# EAGLE design Atmega32U4 (EAGLE 9.6.2)

## Sheet 1 of 2
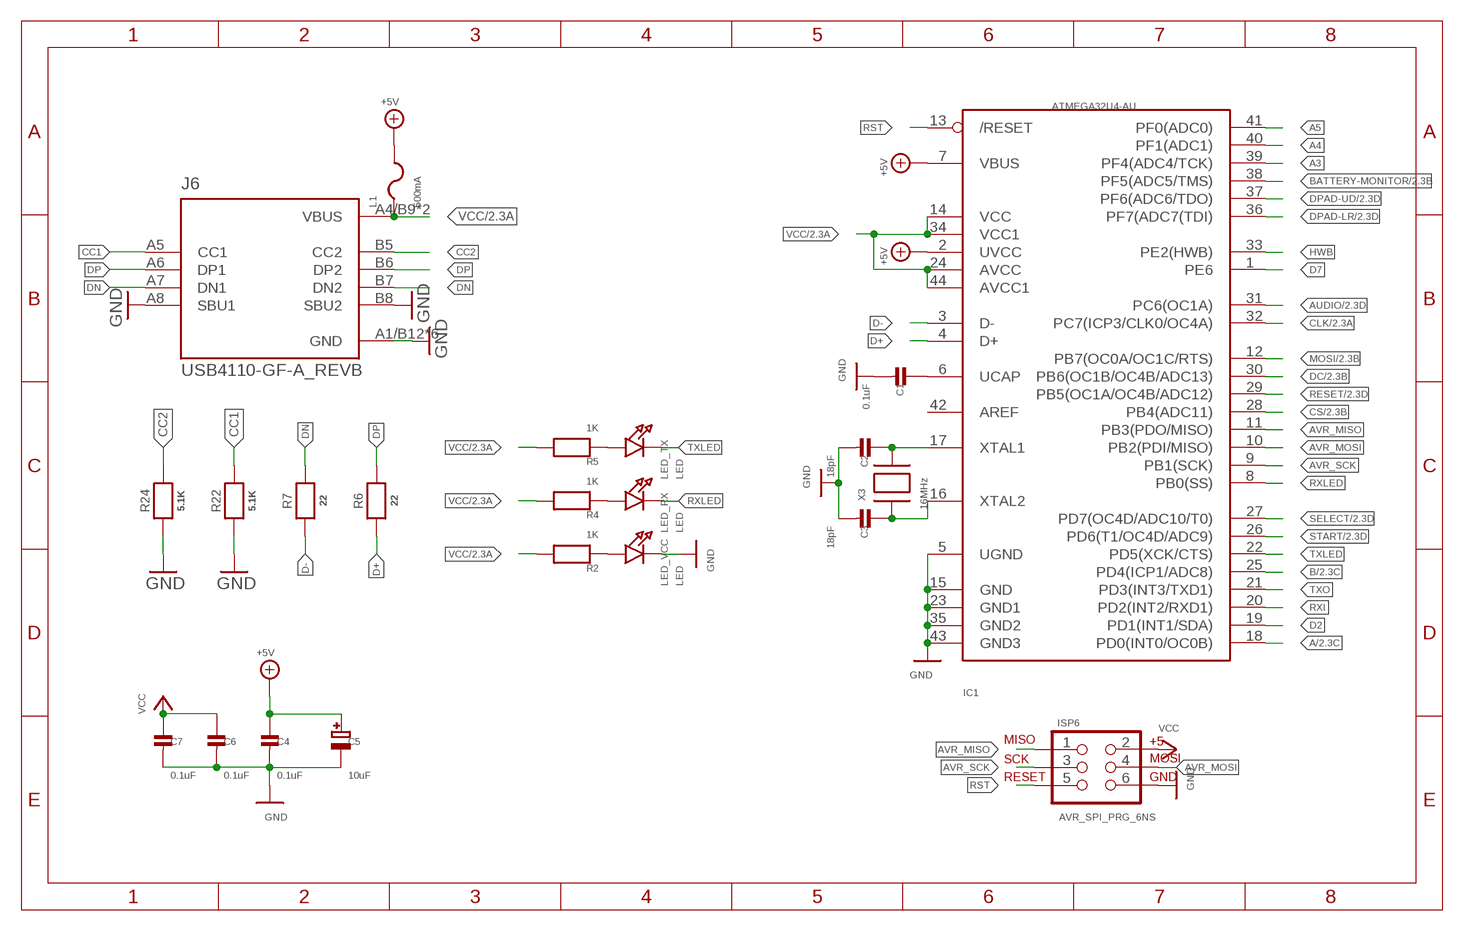
[diagram p0: schematic, sheet 1]

### Parts
C1  0.1uF  CAP_CERAMIC  [0603-MINI-CAP]
C2  18pF  CAP_CERAMIC  [0603-MINI-CAP]
C3  18pF  CAP_CERAMIC  [0603-MINI-CAP]
C4  0.1uF  CAP_CERAMIC  [0603-MINI-CAP]
C5  10uF  CAP_TANTALUMA/3216_WAVE  [EIA3216-18/A-W]
C6  0.1uF  CAP_CERAMIC  [0603-MINI-CAP]
C7  0.1uF  CAP_CERAMIC  [0603-MINI-CAP]
IC1  ATMEGA32U4-AU  [TQFP44]
ISP6  AVR_SPI_PRG_6NS  [2X3-NS]
J6  USB4110-GF-A_REVB  [GCT_USB4110-GF-A_REVB]
L1  500mA  PTCFUSE-1206  [R1206]
LED_RX  LED  LED0603  [CHIPLED_0603]
LED_TX  LED  LED0603  [CHIPLED_0603]
LED_VCC  LED  LED0603  [CHIPLED_0603]
R2  1K  RESISTOR0603MINI  [0603-MINI]
R4  1K  RESISTOR0603MINI  [0603-MINI]
R5  1K  RESISTOR0603MINI  [0603-MINI]
R6  22  RESISTOR0603MINI  [0603-MINI]
R7  22  RESISTOR0603MINI  [0603-MINI]
R22  5.1K  RESISTOR0603MINI  [0603-MINI]
R24  5.1K  RESISTOR0603MINI  [0603-MINI]
X3  16MHz  XTALNX5032  [NX5032]

### Nets
+5V: C4.1 C5.+ IC1.2(UVCC) IC1.7(VBUS) L1.2
A: IC1.18(PD0(INT0/OC0B)) ; also sheet 2
A3: IC1.39(PF4(ADC4/TCK))
A4: IC1.40(PF1(ADC1))
A5: IC1.41(PF0(ADC0))
AUDIO: IC1.31(PC6(OC1A)) ; also sheet 2
AVR_MISO: IC1.11(PB3(PDO/MISO)) ISP6.1
AVR_MOSI: IC1.10(PB2(PDI/MISO)) ISP6.4
AVR_SCK: IC1.9(PB1(SCK)) ISP6.3
B: IC1.25(PD4(ICP1/ADC8)) ; also sheet 2
BATTERY-MONITOR: IC1.38(PF5(ADC5/TMS)) ; also sheet 2
CC1: J6.A5(CC1) R22.2
CC2: J6.B5(CC2) R24.2
CLK: IC1.32(PC7(ICP3/CLK0/OC4A)) ; also sheet 2
CS: IC1.28(PB4(ADC11)) ; also sheet 2
D2: IC1.19(PD1(INT1/SDA))
D7: IC1.1(PE6)
D+: IC1.4(D+) R6.1
D-: IC1.3(D-) R7.1
DC: IC1.30(PB6(OC1B/OC4B/ADC13)) ; also sheet 2
DN: J6.A7(DN1) J6.B7(DN2) R7.2
DP: J6.A6(DP1) J6.B6(DP2) R6.2
DPAD-LR: IC1.36(PF7(ADC7(TDI)) ; also sheet 2
DPAD-UD: IC1.37(PF6(ADC6/TDO)) ; also sheet 2
GND: C1.2 C2.2 C3.2 C4.2 C5.- C6.2 C7.2 IC1.5(UGND) IC1.15(GND) IC1.23(GND1) IC1.35(GND2) IC1.43(GND3) ISP6.6 J6.A1/B12(GND) J6.A8(SBU1) J6.B1/A12(GND) J6.B8(SBU2) J6.S1(GND) J6.S2(GND) J6.S3(GND) J6.S4(GND) LED_VCC.C R22.1 R24.1 ; also sheet 2
HWB: IC1.33(PE2(HWB))
MOSI: IC1.12(PB7(OC0A/OC1C/RTS)) ; also sheet 2
N$2: LED_VCC.A R2.1
N$4: C1.1 IC1.6(UCAP)
N$6: LED_RX.A R4.1
N$7: LED_TX.A R5.1
N$8: C2.1 IC1.17(XTAL1) X3.P$2
N$9: C3.1 IC1.16(XTAL2) X3.P$1
RESET: IC1.29(PB5(OC1A/OC4B/ADC12)) ; also sheet 2
RST: IC1.13(/RESET) ISP6.5
RXI: IC1.20(PD2(INT2/RXD1))
RXLED: IC1.8(PB0(SS)) LED_RX.C
SELECT: IC1.27(PD7(OC4D/ADC10/T0)) ; also sheet 2
START: IC1.26(PD6(T1/OC4D/ADC9)) ; also sheet 2
TXLED: IC1.22(PD5(XCK/CTS)) LED_TX.C
TXO: IC1.21(PD3(INT3/TXD1))
VCC: C6.1 C7.1 IC1.14(VCC) IC1.24(AVCC) IC1.34(VCC1) IC1.44(AVCC1) ISP6.2 J6.A4/B9(VBUS) J6.B4/A9(VBUS) L1.1 R2.2 R4.2 R5.2 ; also sheet 2
Unconnected: IC1.42(AREF)

## Sheet 2 of 2: Board and Logos
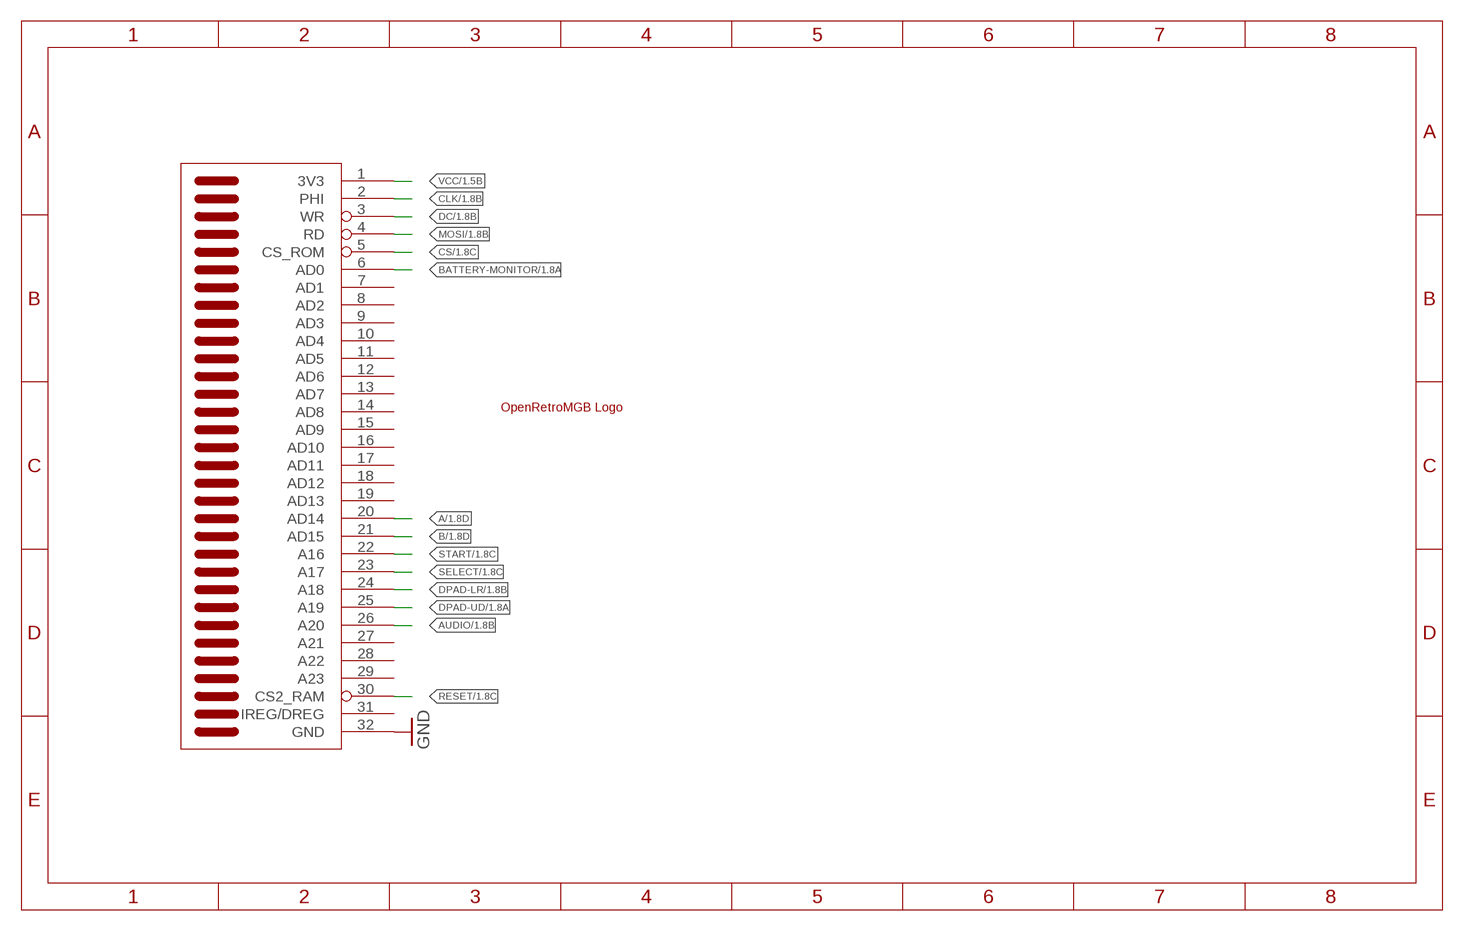
[diagram p1: schematic, sheet 2]

### Parts
U$1  OPENRETROMGB  [OPENRETROMBG]
U$2  GBA_CARTLARGE  [GBCART]

### Nets
A: U$2.20(AD14) ; also sheet 1
AUDIO: U$2.26(A20) ; also sheet 1
B: U$2.21(AD15) ; also sheet 1
BATTERY-MONITOR: U$2.6(AD0) ; also sheet 1
CLK: U$2.2(PHI) ; also sheet 1
CS: U$2.5(CS_ROM) ; also sheet 1
DC: U$2.3(WR) ; also sheet 1
DPAD-LR: U$2.24(A18) ; also sheet 1
DPAD-UD: U$2.25(A19) ; also sheet 1
GND: U$2.32(GND) ; also sheet 1
MOSI: U$2.4(RD) ; also sheet 1
RESET: U$2.30(CS2_RAM) ; also sheet 1
SELECT: U$2.23(A17) ; also sheet 1
START: U$2.22(A16) ; also sheet 1
VCC: U$2.1(3V3) ; also sheet 1
Unconnected: U$2.7(AD1) U$2.8(AD2) U$2.9(AD3) U$2.10(AD4) U$2.11(AD5) U$2.12(AD6) U$2.13(AD7) U$2.14(AD8) U$2.15(AD9) U$2.16(AD10) U$2.17(AD11) U$2.18(AD12) U$2.19(AD13) U$2.27(A21) U$2.28(A22) U$2.29(A23) U$2.31(IREG/DREG)

## Library data of the parts
C1-C4 C6 C7 = RetroESP32:CAP_CERAMIC: Ceramic Capacitors For new designs, use the packages preceded by an '_' character since they are more reliable: The following footprints should be used on most boards: _0402 - Standard footprint for regular board layouts _0603 - Standard footprint for regular board layouts _0805 - Standard footprint for regular board layouts _1206 - Standard footprint for regular board layouts For extremely tight-pitch boards where space is at a premium, the following 'micro-pitch' footprints can be used (smaller pads, no silkscreen outline, etc.): _0402MP - Micro-pitch footprint for very dense/compact boards _0603MP - Micro-pitch footprint for very dense/compact boards _0805MP - Micro-pitch footprint for very dense/compact boards _1206MP - Micro-pitch footprint for very dense/compact boards
C5 = RetroESP32:CAP_TANTALUM: Tantalum Capacitors Wave footprints have larger pads and are meant to be used for hand soldering. Reflow footprints are optimised for solder paste and a reflow oven. EIA3216-18/A-[R/W] - Size A / 3216-18 / 1206 footprint 4.7µF 25V 10% Tantalum Capacitor 10µF 16V 10% Tantalum Capacitor [Digikey: 495-2236-2-ND] EIA3528-21/B-[R/W] - Size B / 3528-21 47µF 10V 10% Tantalum Capactior [Digikey: 495-2216-1-ND] EIA6032-28/C-[R/W] - Size C / 6032-28 10µF 35V 20% Tantalum Capacitor [Digikey: 495-2285-1-ND] 100µF 16V 10% Tantalum Capactior [Digikey: 399-5214-1-ND]
IC1 = adaprog:ATMEGA32U4
ISP6 = SparkFun:AVR_SPI_PRG_6: AVR ISP 6 Pin This is the reduced ISP connector for AVR programming. Common on Arduino. This footprint will take up less PCB space and can be used with a 10-pin to 6-pin adapter such as SKU: BOB-08508
J6 = USB4110-GF-A:USB4110-GF-A_REVB: Check availability <https://pricing.snapeda.com/parts/USB4110-GF-A/GCT/view-part?ref=eda>; AVAILABILITY: In Stock; DESCRIPTION: USB-C (USB TYPE-C) USB 2.0 Receptacle Connector 24 (16+8 Dummy) Position Surface Mount, Right Angle; Through Hole; MF: GCT; MP: USB4110-GF-A; MPN: USB4105-GF-A; PACKAGE: None; PRICE: None; PURCHASE-URL: https://pricing.snapeda.com/search/part/USB4110-GF-A/?ref=eda
L1 = adafruit:PTCFUSE: PTC fuses, resettable thermistors
LED_RX LED_TX LED_VCC = RetroESP32:LED: LED 0603 - 0603 Surface Mount Package 2mA: Green LED - Low Power (3.9mcd, 2ma, 1.7Vf) - Digikey: 475-2709-2-ND Orange LED - Low Power (9.8mcd, 2ma, 1.8Vf) - Digikey: 475-1194-2-ND Red LED - Low Power (5mcd, 2ma, 1.8Vf) - Digikey: 475-1195-2-ND Yellow LED - Low Power (7mcd, 2ma, 1.8Vf) - Digikey: 475-1196-2-ND 5mA: Blue LED - Low Power (17mcd, 5ma, 2.9Vf) - Digikey: LNJ937W8CRACT-ND 0805 - 0805 Surface Mount Package 2mA: Red LED (8.8mcd, 2mA, 1.8Vf, Clear) - Low Power [Digikey: 475-2510-1-ND] Green LED (5mcd, 2mA, 1.8Vf, Clear) - Low Power [Digikey: 475-2730-1-ND] Yellow LED (11.3mcd, 2mA, 1.8Vf, Clear) - Low Power [Digikey: 475-2555-1-ND] 20mA: Red LED (104mcd, 20mA, Diffused) - LS R976 [Digikey: 475-1278-6-ND] Red LED (12mcd, 20mA, 2.0Vf, Clear) - APT2012EC [Digikey: 754-1128-1-ND] Green LED (15mcd, 20mA, 2.2Vf, Clear) - APT2012GC [Digikey: 754-1131-1-ND] Orange LED (160mcd, 20mA, 2.1Vf, Clear) - APT2012SECK [Digikey: 754-1130-1-ND] 1206 - 1206 Surface Mount Package Green LED (26mcd, 20mA, Diffused) - LG N971 [Digikey: 475-1407-6-ND] Red LED (15mcd, 20mA, Diffused) - LH N974 [Digikey: 475-1416-6-ND]
R2 R4 R5 = RetroESP32:RESISTOR: Resistors For new designs, use the packages preceded by an '_' character since they are more reliable: The following footprints should be used on most boards: _0402 - Standard footprint for regular board layouts _0603 - Standard footprint for regular board layouts _0805 - Standard footprint for regular board layouts _1206 - Standard footprint for regular board layouts For extremely tight-pitch boards where space is at a premium, the following 'micro-pitch' footprints can be used (smaller pads, no silkscreen outline, etc.): _0402MP - Micro-pitch footprint for very dense/compact boards _0603MP - Micro-pitch footprint for very dense/compact boards _0805MP - Micro-pitch footprint for very dense/compact boards _1206MP - Micro-pitch footprint for very dense/compact boards
R6 R7 = RetroESP32:RESISTOR: Resistors For new designs, use the packages preceded by an '_' character since they are more reliable: The following footprints should be used on most boards: _0402 - Standard footprint for regular board layouts _0603 - Standard footprint for regular board layouts _0805 - Standard footprint for regular board layouts _1206 - Standard footprint for regular board layouts For extremely tight-pitch boards where space is at a premium, the following 'micro-pitch' footprints can be used (smaller pads, no silkscreen outline, etc.): _0402MP - Micro-pitch footprint for very dense/compact boards _0603MP - Micro-pitch footprint for very dense/compact boards _0805MP - Micro-pitch footprint for very dense/compact boards _1206MP - Micro-pitch footprint for very dense/compact boards; MPN: ERJ-3EKF22R0V
R22 R24 = RetroESP32:RESISTOR: Resistors For new designs, use the packages preceded by an '_' character since they are more reliable: The following footprints should be used on most boards: _0402 - Standard footprint for regular board layouts _0603 - Standard footprint for regular board layouts _0805 - Standard footprint for regular board layouts _1206 - Standard footprint for regular board layouts For extremely tight-pitch boards where space is at a premium, the following 'micro-pitch' footprints can be used (smaller pads, no silkscreen outline, etc.): _0402MP - Micro-pitch footprint for very dense/compact boards _0603MP - Micro-pitch footprint for very dense/compact boards _0805MP - Micro-pitch footprint for very dense/compact boards _1206MP - Micro-pitch footprint for very dense/compact boards; MPN: ERJ-PA3F5101V
U$1 = RetroESP32:OPENRETROMGB
U$2 = gameboy:GBA_CART
X3 = adaprog:XTAL

## Board
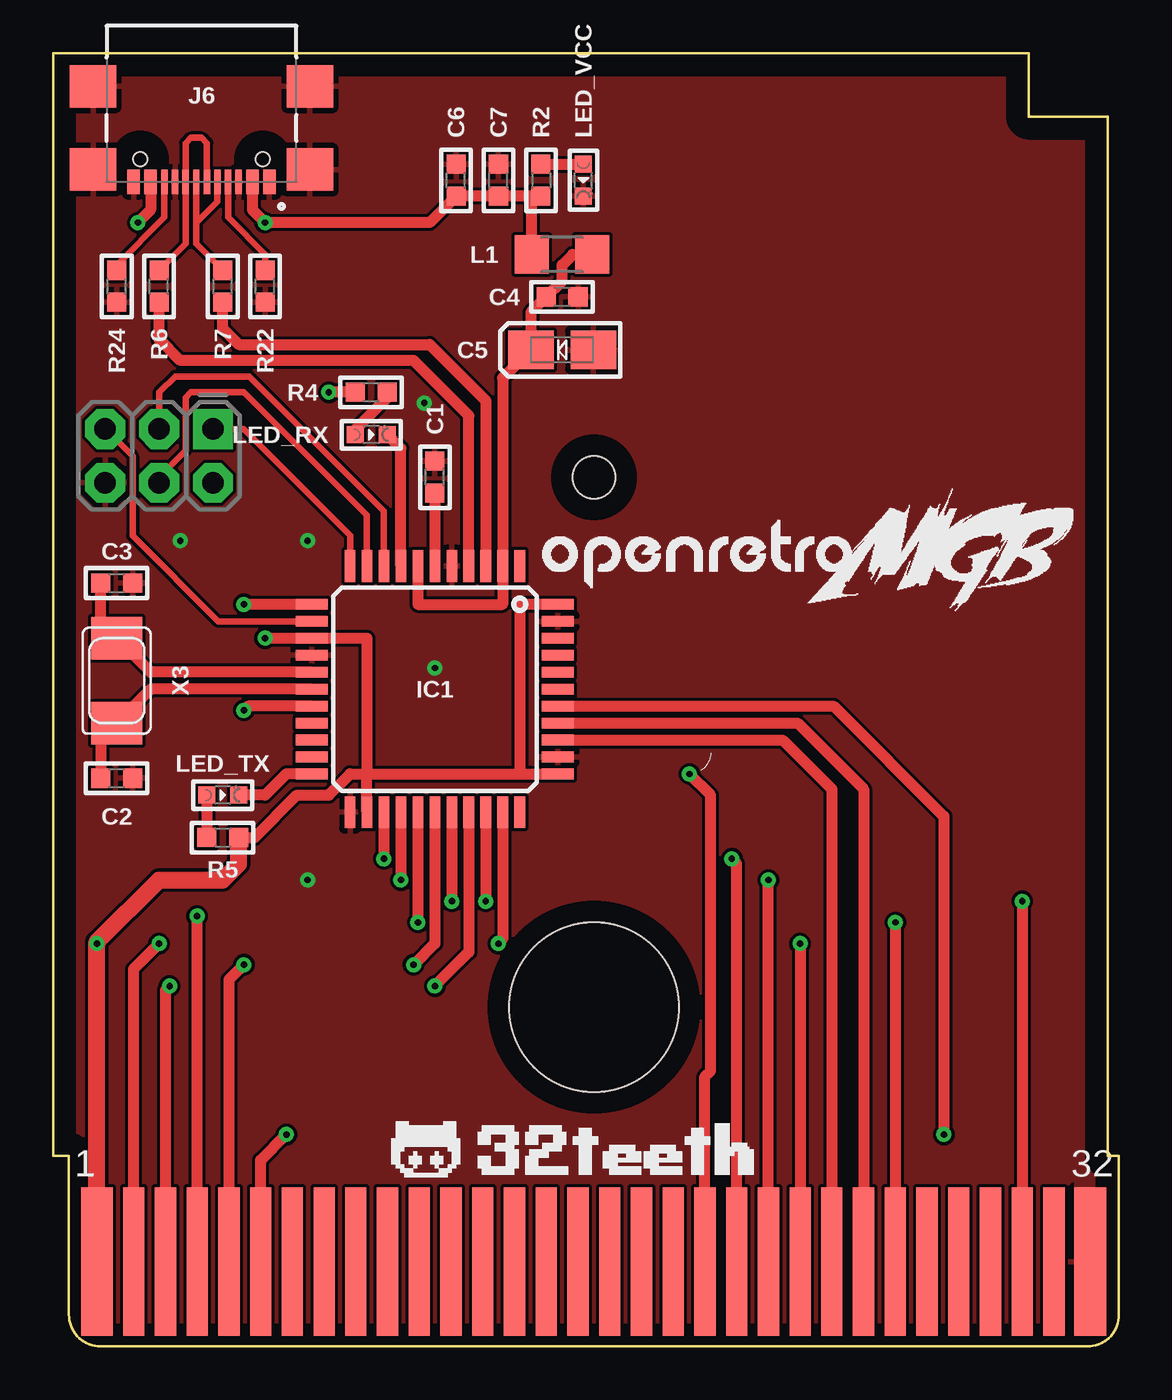
[diagram p2: board, top side]
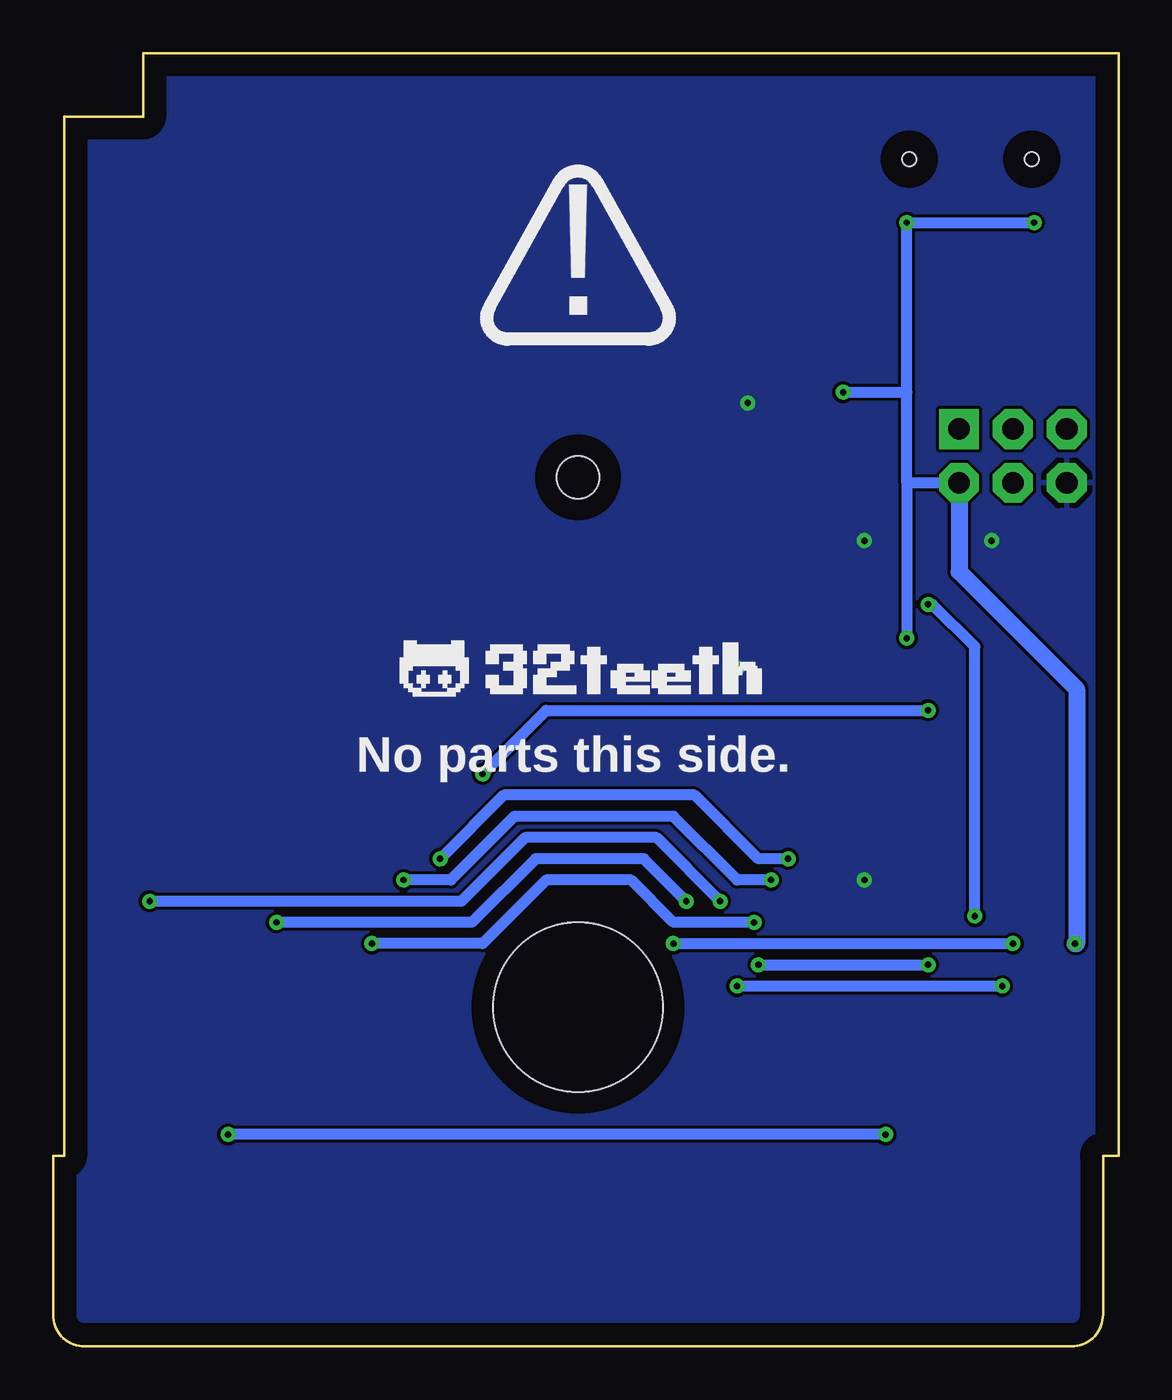
[diagram p3: board, bottom side, seen from below]

Size 50.25 x 61 mm. Coordinates in mm from the lower left corner, seen from the top.
Copper layers (1*16): Top 0.035mm / dielectric 1.5mm / Bottom 0.035mm
Design rules "default": minimum track width 6mil, minimum drill 0.35mm, track to track 6mil, track to pad 6mil, pad to pad 6mil, via to via 6mil, smd to smd 6mil, copper to edge 40mil, drill to drill 6mil, minimum pad ring 10mil, minimum via ring 8mil, stop-mask expansion 4mil, vias tented up to drill 0mil, thermal gap 10mil

### Footprints (pad centres in the part's own frame; a part is rotated, then mirrored left to right if it is on the bottom)
0603-MINI-CAP = smd 0.9 x 0.9: 1 -0.75,0; 2 0.75,0
EIA3216-18/A-W = smd 2.15 x 1.8: + 1.475,0; - -1.475,0
TQFP44 = smd 1.5 x 0.5: 1 -5.8,4; 2 -5.8,3.2; 3 -5.8,2.4; 4 -5.8,1.6; 5 -5.8,0.8; 6 -5.8,0; 7 -5.8,-0.8; 8 -5.8,-1.6; 9 -5.8,-2.4; 10 -5.8,-3.2; 11 -5.8,-4; 23 5.8,-4; 24 5.8,-3.2; 25 5.8,-2.4; 26 5.8,-1.6; 27 5.8,-0.8; 28 5.8,0; 29 5.8,0.8; 30 5.8,1.6; 31 5.8,2.4; 32 5.8,3.2; 33 5.8,4 | smd 0.5 x 1.5: 12 -4,-5.8; 13 -3.2,-5.8; 14 -2.4,-5.8; 15 -1.6,-5.8; 16 -0.8,-5.8; 17 0,-5.8; 18 0.8,-5.8; 19 1.6,-5.8; 20 2.4,-5.8; 21 3.2,-5.8; 22 4,-5.8; 34 4,5.8; 35 3.2,5.8; 36 2.4,5.8; 37 1.6,5.8; 38 0.8,5.8; 39 0,5.8; 40 -0.8,5.8; 41 -1.6,5.8; 42 -2.4,5.8; 43 -3.2,5.8; 44 -4,5.8
2X3-NS = drill 1.016 pad 1.88 square: 1 -2.54,-1.27 | drill 1.016 pad 1.88 octagon: 2 -2.54,1.27; 3 0,-1.27; 4 0,1.27; 5 2.54,-1.27; 6 2.54,1.27
GCT_USB4110-GF-A_REVB = smd 0.6 x 1.15: A1/B12 -3.2,1.075; A4/B9 -2.4,1.075; B1/A12 3.2,1.075; B4/A9 2.4,1.075 | smd 0.3 x 1.15: A5 -1.25,1.075; A6 -0.25,1.075; A7 0.25,1.075; A8 1.25,1.075; B5 1.75,1.075; B6 0.75,1.075; B7 -0.75,1.075; B8 -1.75,1.075 | smd 2.18 x 2: S1 -5.11,0.5; S2 5.11,0.5; S3 -5.11,-3.43; S4 5.11,-3.43 | hole 0.65: -2.89,0; 2.89,0
R1206 = smd 1.6 x 1.803: 1 -1.422,0; 2 1.422,0
CHIPLED_0603 = smd 0.8 x 0.8: A 0,-0.75; C 0,0.75
0603-MINI = smd 0.9 x 0.9: 1 -0.75,0; 2 0.75,0
GBCART = smd 1.5 x 7: 1 2.07,4; 32 48.9,4 | smd 1 x 7: 2 3.803,4; 3 5.299,4; 4 6.795,4; 5 8.291,4; 6 9.787,4; 7 11.283,4; 8 12.78,4; 9 14.276,4; 10 15.772,4; 11 17.268,4; 12 18.764,4; 13 20.26,4; 14 21.756,4; 15 23.252,4; 16 24.748,4; 17 26.244,4; 18 27.74,4; 19 29.236,4; 20 30.732,4; 21 32.228,4; 22 33.724,4; 23 35.22,4; 24 36.716,4; 25 38.213,4; 26 39.709,4; 27 41.205,4; 28 42.701,4; 29 44.197,4; 30 45.693,4; 31 47.189,4 | hole 8: 25.5,16 | hole 2: 25.5,41
NX5032 = smd 2 x 2.4: P$1 2,0; P$2 -2,0

### Placement (x,y rotation side)
C1  18,41 90 top
C2  3,26.8 0 top
C3  3,36 0 top
C4  24,49.5 0 top
C5  24,47 180 top
C6  19,55 90 top
C7  21,55 90 top
IC1  18,31 270 top
ISP6  5,42 180 top
J6  7,56 180 top
L1  24,51.5 0 top
LED_RX  15,43 270 top
LED_TX  8,26 270 top
LED_VCC  25,55 180 top
R2  23,55 270 top
R4  15,45 180 top
R5  8,24 0 top
R6  5,50 90 top
R7  8,50 90 top
R22  10,50 90 top
R24  3,50 90 top
U$1  23,35 0 top
U$2  0,0 0 top
X3  3,31.4 90 top

### Tracks (layer width: path | path; a pad name or v marks a point on that pad's centre or on a via)
+5V
  Top 0.508: IC1.7 17.2,35 21.2,35 IC1.2 21.2,45.67 C5.+ 22.52,48.77 C4.1 24,50.25 24,51 24.5,51.5 L1.2
A  (via drill 0.3)
  Top 0.508: IC1.18 9.2,30.2 v9,30 | U$2.20 30.73,12.73 31,13 31,26 v30,27
  Bottom 0.508: v30,27 27,30 v9,30
AUDIO  (via drill 0.3)
  Top 0.508: IC1.31 v20.4,21 | v39.71,20 U$2.26
  Bottom 0.508: v20.4,21 22.4,23 27.5,23 30.5,20 v39.71,20
AVR_MISO
  Top 0.305: ISP6.1 8.98,43.27 14,38.25 IC1.11
AVR_MOSI
  Top 0.305: ISP6.4 5,41 6.25,42.25 6.25,44.75 6.5,45 9,45 14.8,39.2 IC1.10
AVR_SCK
  Top 0.305: ISP6.3 5,45 5.75,45.75 9.25,45.75 15.6,39.4 IC1.9
B  (via drill 0.3)
  Top 0.508: IC1.25 v15.6,23 | U$2.21 32.23,22.77 v32,23
  Bottom 0.508: v15.6,23 17,23 20,26 29,26 v32,23
BATTERY-MONITOR  (via drill 0.3)
  Top 0.508: U$2.6 9.79,8.79 v11,10 | IC1.38 36.8,30.2 42,25 v42,10
  Bottom 0.508: v11,10 v42,10
CC1
  Top 0.305: J6.A5 8.25,53.25 10,51.5 R22.2
CC2
  Top 0.305: J6.B5 5.25,53.25 3,51 R24.2
CLK  (via drill 0.3)
  Top 0.508: v21,19 21.2,19.2 IC1.32 | U$2.2 3.8,17.8 v5,19
  Bottom 0.508: v21,19 v5,19
CS  (via drill 0.3)
  Top 0.508: v17,18 18,19 IC1.28 | v9,18 8.29,17.29 U$2.5
  Bottom 0.508: v17,18 v9,18
D+
  Top 0.508: IC1.4 19.6,43.9 17,46.5 6,46.5 5,47.5 R6.1
D-
  Top 0.508: IC1.3 20.4,44.6 17.75,47.25 8.75,47.25 8,48 R7.1
DC  (via drill 0.3)
  Top 0.508: IC1.30 19.6,18.6 v18,17 | v5.5,17 5.3,16.8 U$2.3
  Bottom 0.508: v18,17 v5.5,17
DN
  Top 0.305: J6.A7 6.75,53 | 6.75,53 6.75,52 R7.2 7.75,51 | J6.B7 7.75,54 6.75,53
DP
  Top 0.305: J6.A6 7.25,56.75 7,57 6.5,57 6.25,56.75 J6.B6 6.25,52 R6.2
DPAD-LR
  Top 0.508: IC1.36 34.4,28.6 36.72,26.28 U$2.24
DPAD-UD
  Top 0.508: IC1.37 35.1,29.4 38.21,26.29 U$2.25
GND  (via drill 0.3)
  other vias: 17.5,44.5 18,32 12,38 6,38 12,22
  pour Top (rank 2): 0,0 49.75,0 49.75,58 46,58 46,61 0,61
  pour Bottom: 0,0 0,61 46,61 46,58 49.75,58 49.75,0
  pour Top (no thermals): 48.15,9 50,9 50,0 48.15,0
MOSI  (via drill 0.3)
  Top 0.508: IC1.12 v9,35 | U$2.4 v6.79,20.3
  Bottom 0.508: v9,35 8.79,35 6.79,33 v6.79,20.3
N$2
  Top 0.508: R2.1 LED_VCC.A
N$4
  Top 0.508: C1.1 IC1.6
N$6
  Top 0.508: R4.1 15.75,44.75 14.25,43.25 LED_RX.A
N$7
  Top 0.508: LED_TX.A R5.1
N$8
  Top 0.508: IC1.17 4.6,31 X3.P$2 2.25,28.65 C2.1
N$9
  Top 0.508: IC1.16 4.6,31.8 X3.P$1 2.25,34.15 C3.1
RESET  (via drill 0.3)
  Top 0.508: IC1.29 v18.8,21 | v45.69,21 U$2.30
  Bottom 0.508: v18.8,21 21.8,24 28,24 31,21 v45.69,21
RST
  Top 0.305: ISP6.5 3.75,41.98 3.75,38.25 7.8,34.2 IC1.13
RXLED
  Top 0.508: IC1.8 16.4,42.35 LED_RX.C
SELECT  (via drill 0.3)
  Top 0.508: IC1.27 v17.2,20 | v35.22,19 U$2.23
  Bottom 0.508: v17.2,20 21,20 23,22 27,22 30,19 v35.22,19
START  (via drill 0.3)
  Top 0.508: IC1.26 v16.4,22 | U$2.22 33.72,21.78 v33.72,22
  Bottom 0.508: v16.4,22 18,22 21,25 28.5,25 31.5,22 v33.72,22
TXLED
  Top 0.508: IC1.22 11,27 10,26 LED_TX.C
VCC  (via drill 0.3)
  Top 0.508: J6.B4/A9 4.6,53.6 v4,53 | J6.A4/B9 9.4,53.6 v10,53 17.75,53 C6.1 C7.1 R2.2 22.58,54.25 L1.1 | R4.2 v13,45 | v10,33.4 IC1.14 14.8,33.4 14.8,27 | IC1.24 14.8,27 | 14.8,27 22,27 | 22,27 IC1.34 | IC1.44 22,35 22,27 | 14.8,27 14,27 13,26 11.5,26 9.5,24 R5.2
  Top 0.813: U$2.1 v2.07,19 2.07,19.07 5,22 8,22 8.75,22.75 R5.2
  Bottom 0.508: v4,53 v10,53 10,45 | ISP6.2 10,40.73 | 10,40.73 10,45 | v13,45 10,45 | 10,40.73 v10,33.4
  Bottom 0.813: ISP6.2 7.54,36.54 2,31 2,19 v2.07,19